# Altium project Senior_DoorLock.PrjPcb
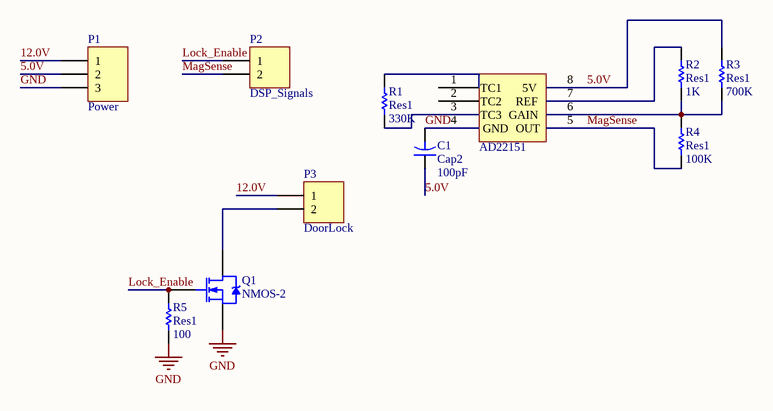
[diagram p0: Senior_DoorLock.SchDoc]
1 sheet, 11 parts. Net scope: global (net labels, ports and power ports of the same name join across sheets).
Board file: Senior_DoorLock.PcbDoc

## Sheet Senior_DoorLock.SchDoc
size A

### Parts
AD22151  AD22151 Breakout  [DIP-8]  (value not drawn)
C1  Cap2  value 100pF  [CAPR5-4X5]
P1  Power  [HDR1X3]
P2  DSP_Signals  [HDR1X2]
P3  DoorLock  [HDR1X2]
Q1  NMOS-2  [TO-220AB]
R1  Res1  value 330K  [AXIAL-0.3]
R2  Res1  value 1K  [AXIAL-0.3]
R3  Res1  value 700K  [AXIAL-0.3]
R4  Res1  value 100K  [AXIAL-0.3]
R5  Res1  value 100  [AXIAL-0.3]

### Nets
GND: AD22151.4(GND) C1.2 P1.3 Q1.3(S) R5.1
5.0V: AD22151.8(5V) C1.1 P1.2 R3.2
12.0V: P1.1 P3.1
Lock_Enable: P2.1 Q1.1(G) R5.2
MagSense: AD22151.5(OUT) P2.2 R4.1
NetAD22151_1: AD22151.1(TC1) R1.2
NetAD22151_3: AD22151.3(TC3) R1.1
NetAD22151_6: AD22151.6(GAIN) R2.1 R3.1 R4.2
NetAD22151_7: AD22151.7(REF) R2.2
NetP3_2: P3.2 Q1.2(D)

Not connected (* = marked no-connect by the designer): AD22151 2(TC2)

### Library data of the parts
AD22151 = AD22151 Breakout: Magnetic Field Sensor
C1 = Cap2: Capacitor; Published: 23-Sep-2002; PackageReference: CAPR5-4X5; Publisher: Altium Limited; PackageDescription: Capacitor; 2 Leads
P1 = Header 3: Header, 3-Pin; LatestRevisionDate: 17-Jul-2002; LatestRevisionNote: Re-released for DXP Platform.; Publisher: Altium Limited
P2 P3 = Header 2: Header, 2-Pin; LatestRevisionDate: 17-Jul-2002; LatestRevisionNote: Re-released for DXP Platform.; Publisher: Altium Limited
Q1 = NMOS-2: N-Channel Power MOSFET; Note: Pin 2 is electrically connected to pin 4.; Published: 8-Jun-2000; LatestRevisionDate: 17-Jul-2002; LatestRevisionNote: Re-released for DXP Platform.; DatasheetVersion: PD-9.814; PackageVersion: Feb-1997; PackageReference: TO-220AB; Publisher: Altium Limited; PackageDescription: TO, Thru-Hole, Vertical, Heatsink Mounted; 3 In-Line Leads; Pitch 2.54 mm; ComponentLink1Description: Manufacturer Link; ComponentLink1URL: http://www.irf.com/
R1-R5 = Res1: Resistor; Published: 8-Jun-2000; LatestRevisionDate: 17-Jul-2002; LatestRevisionNote: Re-released for DXP Platform.; PackageReference: AXIAL-0.3; Publisher: Altium Limited; PackageDescription: Axial Device, Thru-Hole; 2 Leads; 0.3 in Pin Spacing